# Altium schematic sheet [07] EXPANSION.SchDoc: Template
size A4; Author: Hom; CompanyName: KitSprout; DrawnBy: Hom; Engineer: Hom; Organization: KitSprout; Revision: A; SheetNumber: 7; SheetTotal: 7; Version: 0.0; LibVersion: 0.0
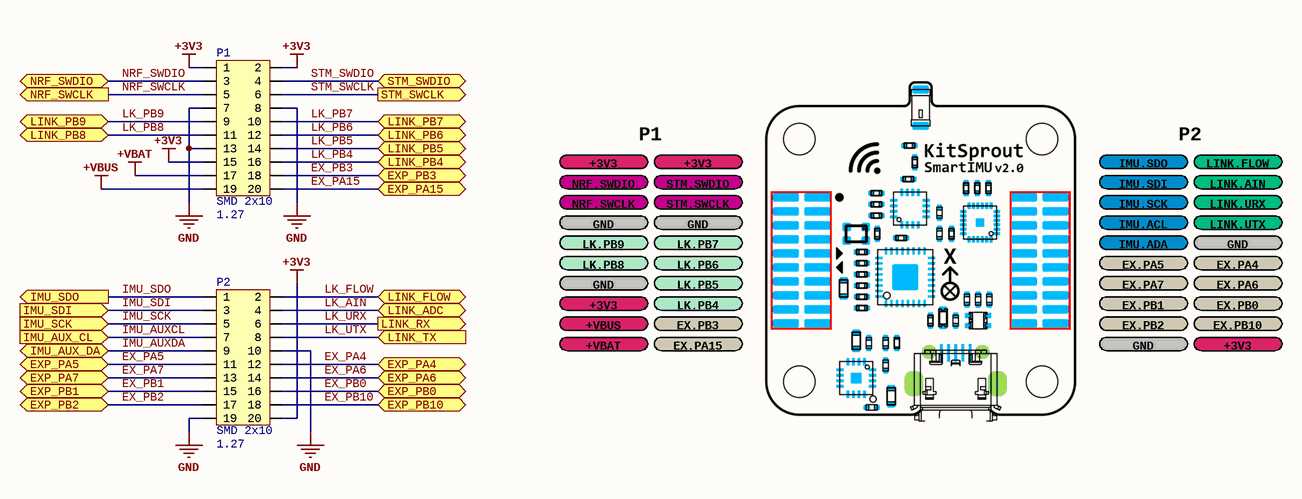
[diagram p0: [07] EXPANSION.SchDoc]

## Parts
P1  Type: SMD 2x10  [HDR2X10_1.27_180TBH]  (hidden comment: 1.27)
P2  Type: SMD 2x10  [HDR2X10_1.27_180TBH]  (hidden comment: 1.27)

## Ports
EXP_PA4 (bidir), EXP_PA5 (bidir), EXP_PA6 (bidir), EXP_PA7 (bidir), EXP_PA15 (bidir), EXP_PB0 (bidir), EXP_PB1 (bidir), EXP_PB2 (bidir), EXP_PB3 (bidir), EXP_PB10 (bidir), IMU_AUX_CL (in), IMU_AUX_DA (bidir), IMU_SCK (in), IMU_SDI (in), IMU_SDO (out), LINK_ADC (bidir), LINK_FLOW (bidir), LINK_PB4 (bidir), LINK_PB5 (bidir), LINK_PB6 (bidir), LINK_PB7 (bidir), LINK_PB8 (bidir), LINK_PB9 (bidir), LINK_RX (out), LINK_TX (in), NRF_SWCLK (out), NRF_SWDIO (bidir), STM_SWCLK (out), STM_SWDIO (bidir)

## Nets
+3V3: P1.1 P1.2 P1.15 P2.20
+VBAT: P1.17
+VBUS: P1.19
GND: P1.7 P1.8 P1.13 P2.10 P2.19
EX_PA4: P2.12 ; port EXP_PA4
EX_PA5: P2.11 ; port EXP_PA5
EX_PA6: P2.14 ; port EXP_PA6
EX_PA7: P2.13 ; port EXP_PA7
EX_PA15: P1.20 ; port EXP_PA15
EX_PB0: P2.16 ; port EXP_PB0
EX_PB1: P2.15 ; port EXP_PB1
EX_PB2: P2.17 ; port EXP_PB2
EX_PB3: P1.18 ; port EXP_PB3
EX_PB10: P2.18 ; port EXP_PB10
IMU_AUXCL: P2.7 ; port IMU_AUX_CL
IMU_AUXDA: P2.9 ; port IMU_AUX_DA
IMU_SCK: P2.5 ; port IMU_SCK
IMU_SDI: P2.3 ; port IMU_SDI
IMU_SDO: P2.1 ; port IMU_SDO
LK_AIN: P2.4 ; port LINK_ADC
LK_FLOW: P2.2 ; port LINK_FLOW
LK_PB4: P1.16 ; port LINK_PB4
LK_PB5: P1.14 ; port LINK_PB5
LK_PB6: P1.12 ; port LINK_PB6
LK_PB7: P1.10 ; port LINK_PB7
LK_PB8: P1.11 ; port LINK_PB8
LK_PB9: P1.9 ; port LINK_PB9
LK_URX: P2.6 ; port LINK_RX
LK_UTX: P2.8 ; port LINK_TX
NRF_SWCLK: P1.5 ; port NRF_SWCLK
NRF_SWDIO: P1.3 ; port NRF_SWDIO
STM_SWCLK: P1.6 ; port STM_SWCLK
STM_SWDIO: P1.4 ; port STM_SWDIO

## Notes on the sheet
- +3V3
- P1
- IMU.SDO
- P2
- LINK.FLOW
- NRF.SWDIO
- NRF.SWCLK
- GND
- STM.SWDIO
- STM.SWCLK
- IMU.SDI
- IMU.SCK
- IMU.ACL
- LINK.AIN
- LINK.URX
- LINK.UTX
- LK.PB9
- LK.PB8
- LK.PB7
- LK.PB6
- LK.PB5
- IMU.ADA
- EX.PA5
- EX.PA7
- EX.PA4
- EX.PA6
- +VBUS
- +VBAT
- EX.PB3
- EX.PA15
- LK.PB4
- EX.PB1
- EX.PB2
- EX.PB0
- EX.PB10

## Library data of the parts
P1 P2 = HDR2x10_1.27: Header; Value: 1.27